# EAGLE design APDS-9801 (EAGLE 6.4)
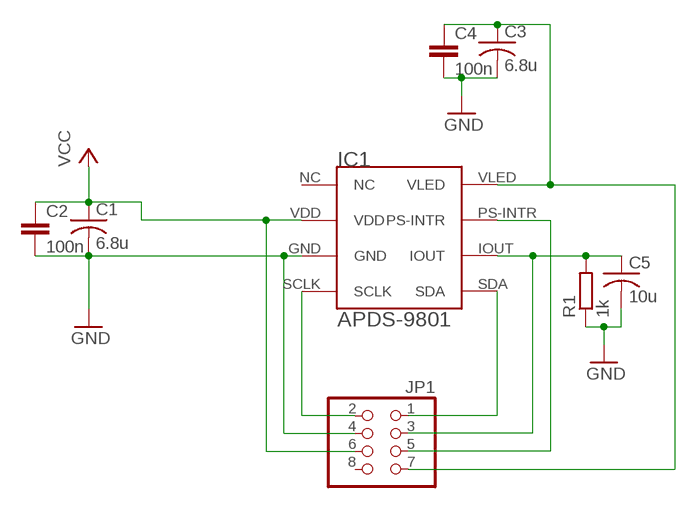
[diagram p0: schematic, sheet 1]

## Parts
C1  6.8u  C-US025-024X044  [C025-024X044]
C2  100n  C-EUC0805  [C0805]
C3  6.8u  C-US025-024X044  [C025-024X044]
C4  100n  C-EUC0805  [C0805]
C5  10u  C-US025-024X044  [C025-024X044]
IC1  APDS-9801  [APDS-9801]
JP1  PINHD-2X4  [2X04]
R1  1k  R-EU_M0805  [M0805]

## Nets
GND: C1.2 C2.2 C3.2 C4.2 C5.2 IC1.GND JP1.4 R1.1
N$1: IC1.PS-INTR JP1.5
N$3: C5.1 IC1.IOUT JP1.3 R1.2
N$5: C3.1 C4.1 IC1.VLED JP1.7
N$7: IC1.SCLK JP1.2
N$9: IC1.SDA JP1.1
VCC: C1.1 C2.1 IC1.VDD JP1.6
Unconnected: IC1.NC JP1.8

## Library data of the parts
C1 C3 C5 = rcl:C-US: CAPACITOR, American symbol
C2 C4 = rcl:C-EU: CAPACITOR, European symbol
IC1 = BEEP:APDS-9801
JP1 = pinhead:PINHD-2X4: PIN HEADER
R1 = rcl:R-EU_: RESISTOR, European symbol

## Board
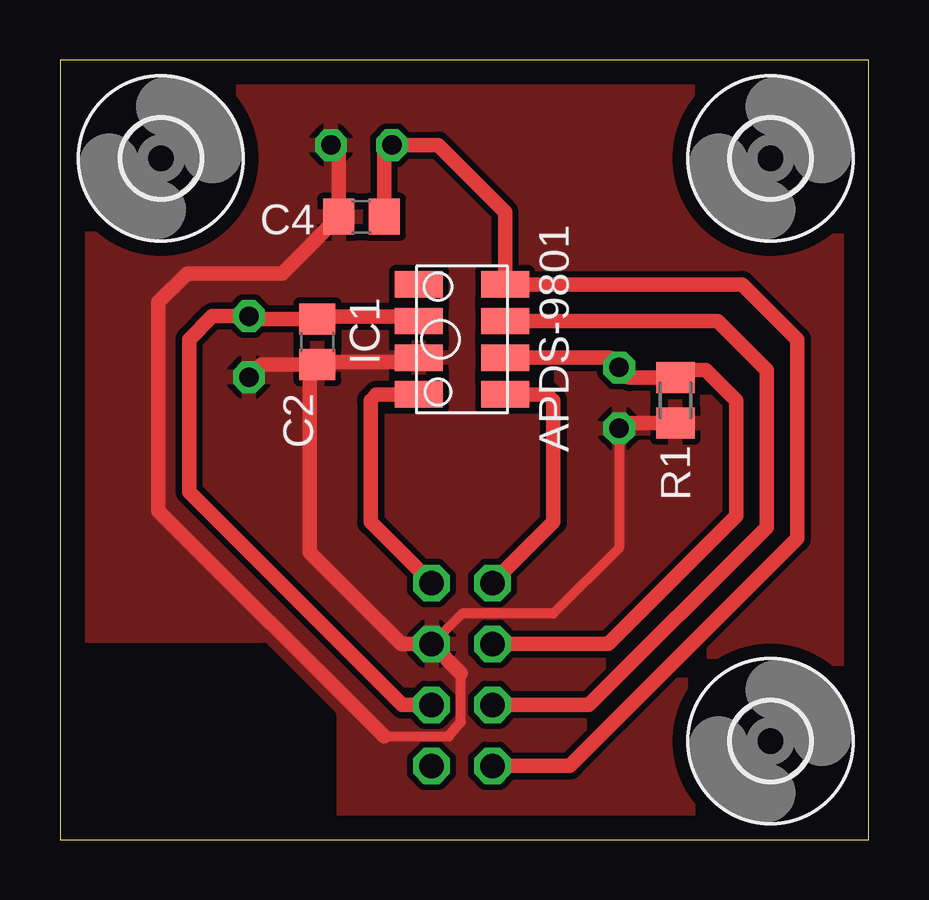
[diagram p1: board, top side]
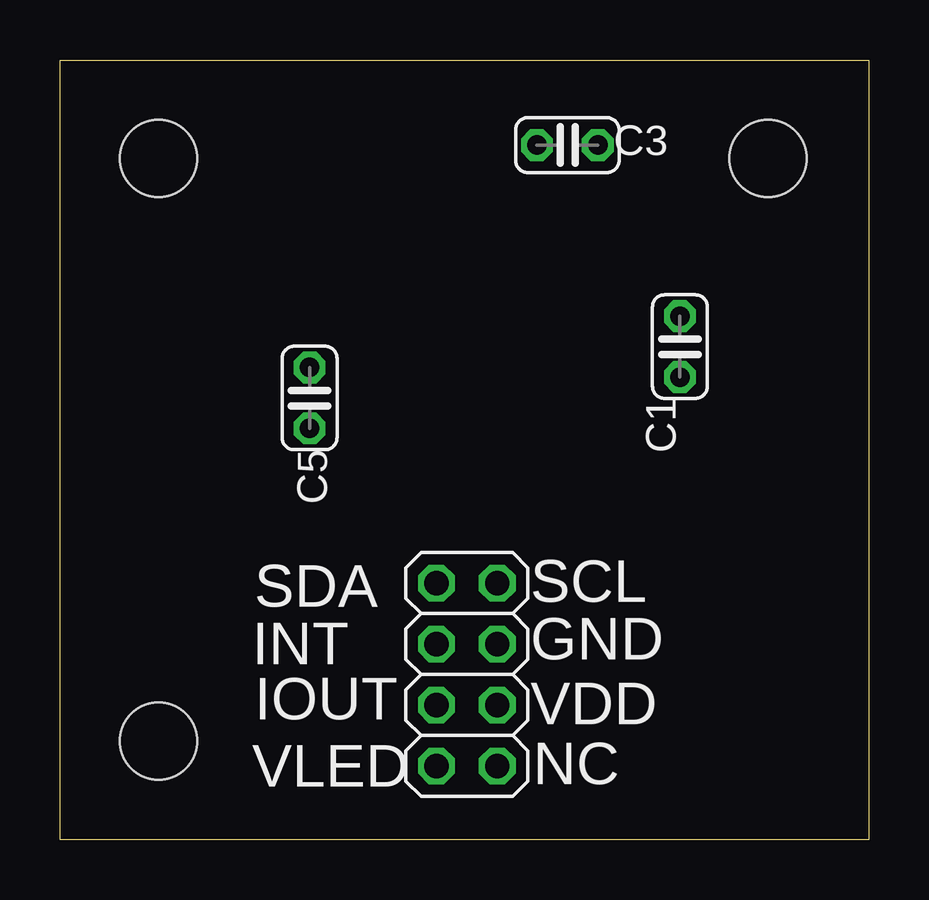
[diagram p2: board, bottom side, seen from below]

Size 33.7 x 32.5 mm. Coordinates in mm from the lower left corner, seen from the top.
Outline: 0,0 33.7,0 33.7,32.5 0,32.5 0,0
Copper layers (1*16): Top 0.035mm / dielectric 1.5mm / Bottom 0.035mm
Design rules "default *": minimum track width 10mil, minimum drill 24mil, track to track 10mil, track to pad 10mil, pad to pad 8mil, via to via 8mil, smd to smd 8mil, copper to edge 40mil, drill to drill 8mil, minimum pad ring 10mil, minimum via ring 8mil, stop-mask expansion 4mil, vias tented up to drill 0mil, thermal gap 10mil
tRestrict: area 1.1,1.1 to 11.3,8

### Footprints (pad centres in the part's own frame; a part is rotated, then mirrored left to right if it is on the bottom)
C025-024X044 = drill 0.813 octagon: 1 -1.27,0; 2 1.27,0
C0805 = smd 1.3 x 1.5: 1 -0.95,0; 2 0.95,0
APDS-9801 = smd 1.1 x 2: GND 0.765,-1.8; IOUT 0.765,1.8; NC -2.295,-1.8; PS-INTR -0.765,1.8; SCLK 2.295,-1.8; SDA 2.295,1.8; VDD -0.765,-1.8; VLED -2.295,1.8
2X04 = drill 1.016 octagon: 1 -3.81,-1.27; 2 -3.81,1.27; 3 -1.27,-1.27; 4 -1.27,1.27; 5 1.27,-1.27; 6 1.27,1.27; 7 3.81,-1.27; 8 3.81,1.27
M0805 = smd 1.3 x 1.6: 1 -0.95,0; 2 0.95,0
3,2 = hole 3.2: 0,0

### Placement (x,y rotation side)
C1  7.87,20.55 270 bottom
C2  10.72,20.75 270 top
C3  12.56,28.95 0 bottom
C4  12.56,25.96 180 top
C5  23.3,18.41 270 bottom
IC1  16.75,20.85 270 top
JP1  16.75,6.88 270 bottom
R1  25.64,18.31 90 top
U$1  [COPPER4]  1,5.5 0 top
U$3  [3,2]  29.6,28.4 0 top
U$4  [3,2]  4.2,28.4 0 top
U$5  [3,2]  29.6,4.1 0 top

### Tracks (layer width: path | path; a pad name or v marks a point on that pad's centre or on a via)
GND
  Top 0.406: 13.5,4.3 16.2,4.3 16.7,4.9 16.7,6.93 | JP1.4 16.75,9.42 20.56,9.42 23.3,12.16 C5.2
  Top 0.61: IC1.GND 14.77,19.9 10.82,19.9 C2.2 | 13.5,4.3 4.1,13.7 4.1,22.4 5.3,23.6 9.25,23.6 C4.2 11.61,28.63 C3.2 | 16.7,6.93 JP1.4 14.21,8.15 10.4,11.96 10.4,19.48 C2.2 | C2.2 8.39,19.8 C1.2 | R1.1 23.52,17.36 C5.2
  pour Top: 0,32.5 33.7,32.5 33.7,0 0,0
N$1
  Top 0.61: IC1.PS-INTR 27.41,21.61 29.45,19.58 29.45,13.02 22.04,5.61 JP1.5
N$3
  Top 0.61: IC1.IOUT 22.89,20.09 C5.1 23.72,19.26 R1.2 25.96,19.58 26.91,19.58 28.18,18.31 28.18,13.49 22.84,8.15 JP1.3
N$5
  Top 0.61: JP1.7 21.24,3.07 30.72,12.55 30.72,20.85 28.43,23.14 IC1.VLED 18.55,26.15 15.75,28.95 C3.1 13.51,28.63 C4.1
N$7
  Top 0.61: IC1.SCLK 13.19,18.55 12.94,18.31 12.94,13.23 JP1.2
N$9
  Top 0.61: IC1.SDA 20.32,18.55 20.56,18.31 20.56,13.23 JP1.1
VCC
  Top 0.61: IC1.VDD 14.77,21.8 10.82,21.8 C2.1 7.99,21.7 C1.1 6.35,21.82 5.38,20.85 5.38,14.5 14.27,5.61 JP1.6

### Text on the board
bNames: SCL | SDA | GND | INT | VDD | IOUT | NC | VLED
tCName: APDS-9801 / v0.2